# Altium schematic sheet design_note.SchDoc
size A
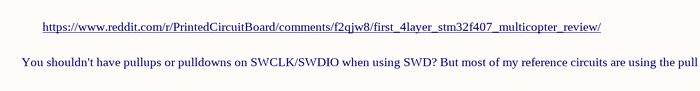
[diagram p0: design_note.SchDoc]

## Notes on the sheet
- You shouldn't have pullups or pulldowns on SWCLK/SWDIO when using SWD? But most of my reference circuits are using the pull resistors
- https://www.reddit.com/r/PrintedCircuitBoard/comments/f2qjw8/first_4layer_stm32f407_multicopter_review/